# EAGLE design Analog_Light_Project_Improved_Schematic (EAGLE 9.2.2)
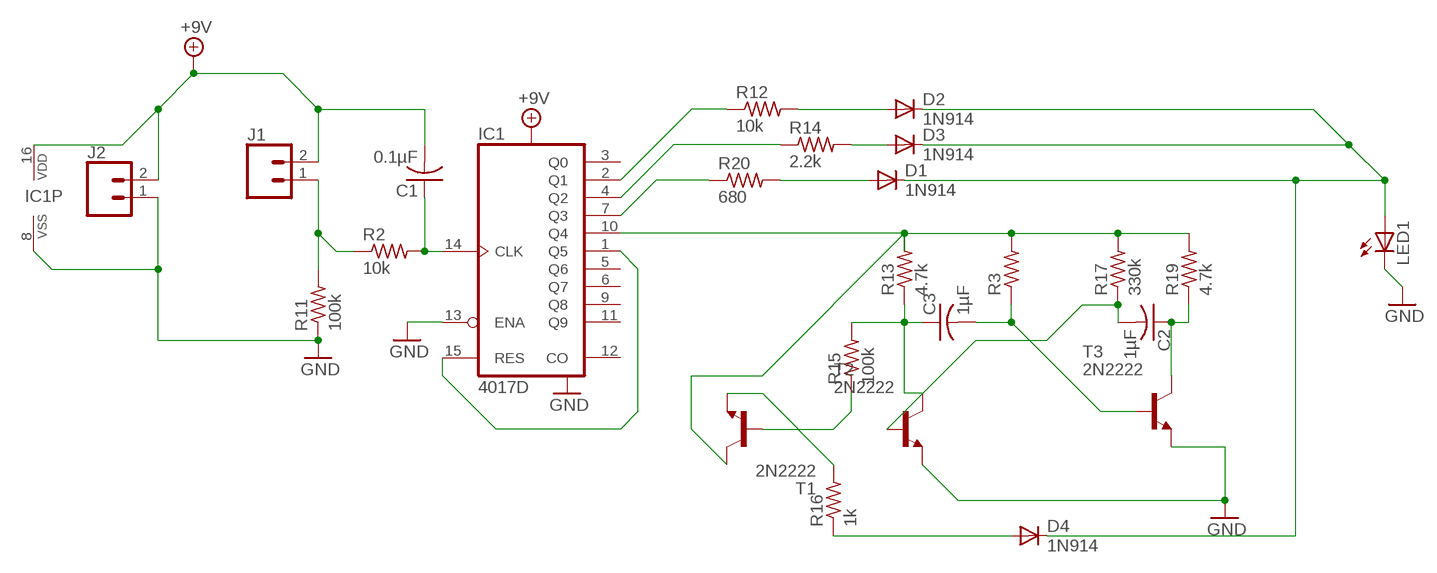
[diagram p0: schematic, sheet 1]

## Parts
C1  0.1µF  C-US025-024X044  [C025-024X044]
C2  1µF  C-USC0805  [C0805]
C3  1µF  C-US025-024X044  [C025-024X044]
D1  1N914  1N4004  [DO41-10]
D2  1N914  1N4004  [DO41-10]
D3  1N914  1N4004  [DO41-10]
D4  1N914  1N4004  [DO41-10]
IC1  4017D  [SO16]
J1  CONN_02  [1X02]
J2  CONN_02  [1X02]
LED1  LED5MM  [LED5MM]
R2  10k  R-US_0204/5  [0204/5]
R3  R-US_0204/5  [0204/5]
R11  100k  R-US_M0805  [M0805]
R12  10k  R-US_M0805  [M0805]
R13  4.7k  R-US_M0805  [M0805]
R14  2.2k  R-US_M0805  [M0805]
R15  100k  R-US_M0805  [M0805]
R16  1k  R-US_M0805  [M0805]
R17  330k  R-US_M0805  [M0805]
R19  4.7k  R-US_M0805  [M0805]
R20  680  R-US_M0805  [M0805]
T1  2N2222  [TO92-EBC-OVAL]
T2  2N2222  [TO92-EBC-OVAL]
T3  2N2222  [TO92-EBC-OVAL]

## Nets
+9V: C1.2 IC1.16(VDD) J1.2 J2.2
GND: IC1.8(VSS) IC1.13(ENA) J2.1 LED1.K(C) R11.1 T2.E T3.E
N$1: IC1.10(Q4) R3.2 R13.2 R17.2 R19.2 T1.C
N$2: C3.1 R13.1 R15.2 T2.C
N$3: C3.2 R3.1 T3.B
N$4: C2.2 R17.1 T2.B
N$5: C2.1 R19.1 T3.C
N$6: IC1.7(Q3) R20.1
N$7: R15.1 T1.B
N$9: D1.C D2.C D3.C D4.C LED1.A
N$10: IC1.4(Q2) R14.1
N$11: IC1.2(Q1) R12.1
N$12: C1.1 IC1.14(CLK) R2.2
N$13: IC1.1(Q5) IC1.15(RES)
N$14: D1.A R20.2
N$15: J1.1 R2.1 R11.2
N$16: D3.A R14.2
N$17: D2.A R12.2
N$18: D4.A R16.1
N$19: R16.2 T1.E
Unconnected: IC1.3(Q0) IC1.5(Q6) IC1.6(Q7) IC1.9(Q8) IC1.11(Q9) IC1.12(CO)

## Library data of the parts
C1 C3 = rcl:C-US: CAPACITOR, American symbol; SPICEPREFIX: C
C2 = adafruit:C-US: CAPACITOR, American symbol
D1-D4 = diode:1N4004: DIODE general purpose rectifier, 1 A
IC1 = 40xx:4017: COUNTER/DIVIDER
J1 J2 = SparkFun-Connectors:CONN_02: Multi connection point. Often used as Generic Header-pin footprint for 0.1 inch spaced/style header connections On any of the 0.1 inch spaced packages, you can populate with these: Break Away Headers - Straight <https://www.sparkfun.com/products/116> (PRT-00116) Break Away Male Headers - Right Angle <https://www.sparkfun.com/products/553> (PRT-00553) Female Headers <https://www.sparkfun.com/products/115> (PRT-00115) Break Away Headers - Machine Pin <https://www.sparkfun.com/products/117> (PRT-00117) Break Away Female Headers - Swiss Machine Pin <https://www.sparkfun.com/products/743> (PRT-00743) For SCREWTERMINALS and SPRING TERMINALS visit here: Screw Terimnals on SparkFun.com <https://www.sparkfun.com/search/results?term=Screw+Terminals> (5mm/3.5mm/2.54mm spacing) This device is also useful as a general connection point to wire up your design to another part of your project. Our various solder wires solder well into these plated through hole pads. Hook-Up Wire - Assortment (Stranded, 22 AWG) <https://www.sparkfun.com/products/11375> (PRT-11375) Hook-Up Wire - Assortment (Solid Core, 22 AWG) <https://www.sparkfun.com/products/11367> (PRT-11367) View the entire wire category on our website here <https://www.sparkfun.com/categories/141> Special notes: Molex polarized connector foot print use with: PRT-08233 with associated crimp pins and housings. 2.54_SCREWTERM for use with PRT-10571. 3.5mm Screw Terminal footprints for PRT-08084 5mm Screw Terminal footprints for use with PRT-08432
LED1 = adafruit:LED: LED OSRAM: - CHIPLED LG R971, LG N971, LY N971, LG Q971, LY Q971, LO R971, LY R971 LH N974, LH R974 LS Q976, LO Q976, LY Q976 LO Q996 - Hyper CHIPLED LW Q18S LB Q993, LB Q99A, LB R99A - SideLED LS A670, LO A670, LY A670, LG A670, LP A670 LB A673, LV A673, LT A673, LW A673 LH A674 LY A675 LS A676, LA A676, LO A676, LY A676, LW A676 LS A679, LY A679, LG A679 - Hyper Micro SIDELED® LS Y876, LA Y876, LO Y876, LY Y876 LT Y87S - SmartLED LW L88C, LW L88S LB L89C, LB L89S, LG L890 LS L89K, LO L89K, LY L89K LS L896, LA L896, LO L896, LY L896 - TOPLED LS T670, LO T670, LY T670, LG T670, LP T670 LSG T670, LSP T670, LSY T670, LOP T670, LYG T670 LG T671, LOG T671, LSG T671 LB T673, LV T673, LT T673, LW T673 LH T674 LS T676, LA T676, LO T676, LY T676, LB T676, LH T676, LSB T676, LW T676 LB T67C, LV T67C, LT T67C, LS T67K, LO T67K, LY T67K, LW E67C LS E67B, LA E67B, LO E67B, LY E67B, LB E67C, LV E67C, LT E67C LW T67C LS T679, LY T679, LG T679 LS T770, LO T770, LY T770, LG T770, LP T770 LB T773, LV T773, LT T773, LW T773 LH T774 LS E675, LA E675, LY E675, LS T675 LS T776, LA T776, LO T776, LY T776, LB T776 LHGB T686 LT T68C, LB T68C - Hyper Mini TOPLED® LB M676 - Mini TOPLED Santana® LG M470 LS M47K, LO M47K, LY M47K Source: http://www.osram.convergy.de/
R2 R3 = rcl:R-US_: RESISTOR, American symbol; SPICEPREFIX: R
R11-R17 R19 R20 = adafruit:R-US_: RESISTOR, American symbol
T1-T3 = adafruit:2N2222: NPN TRANSISTOR Big oval pads

## Board
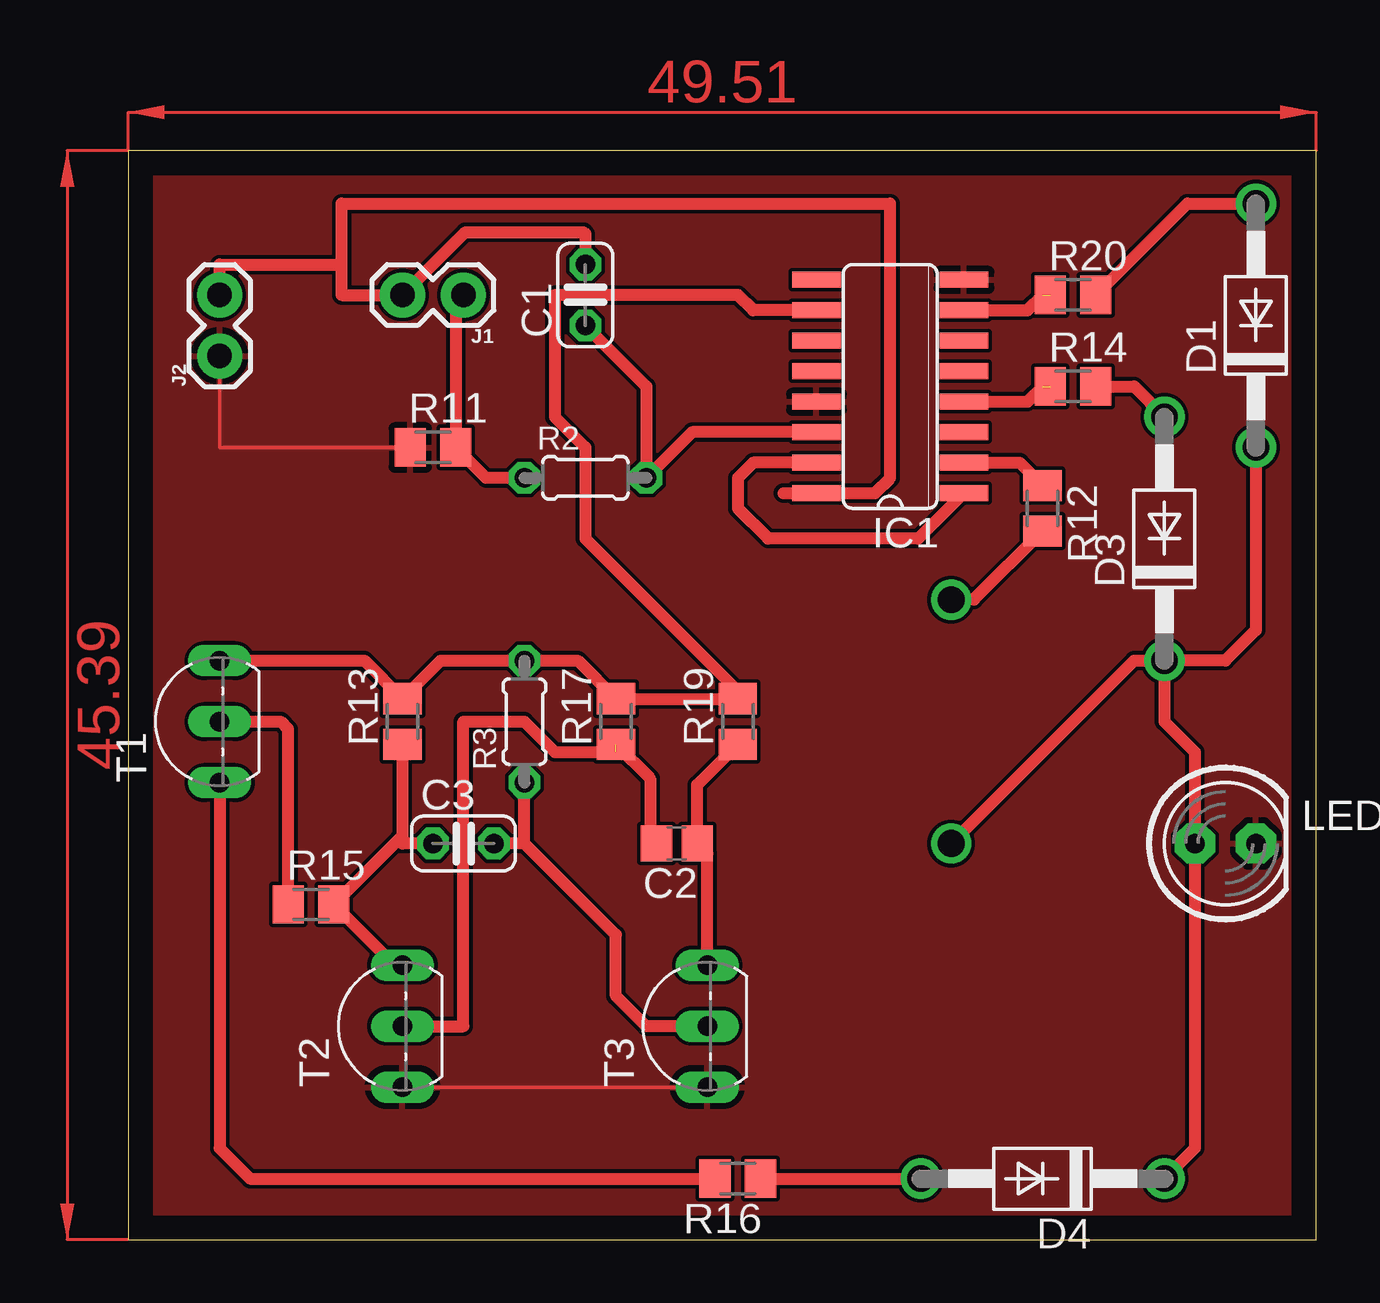
[diagram p1: board, top side]
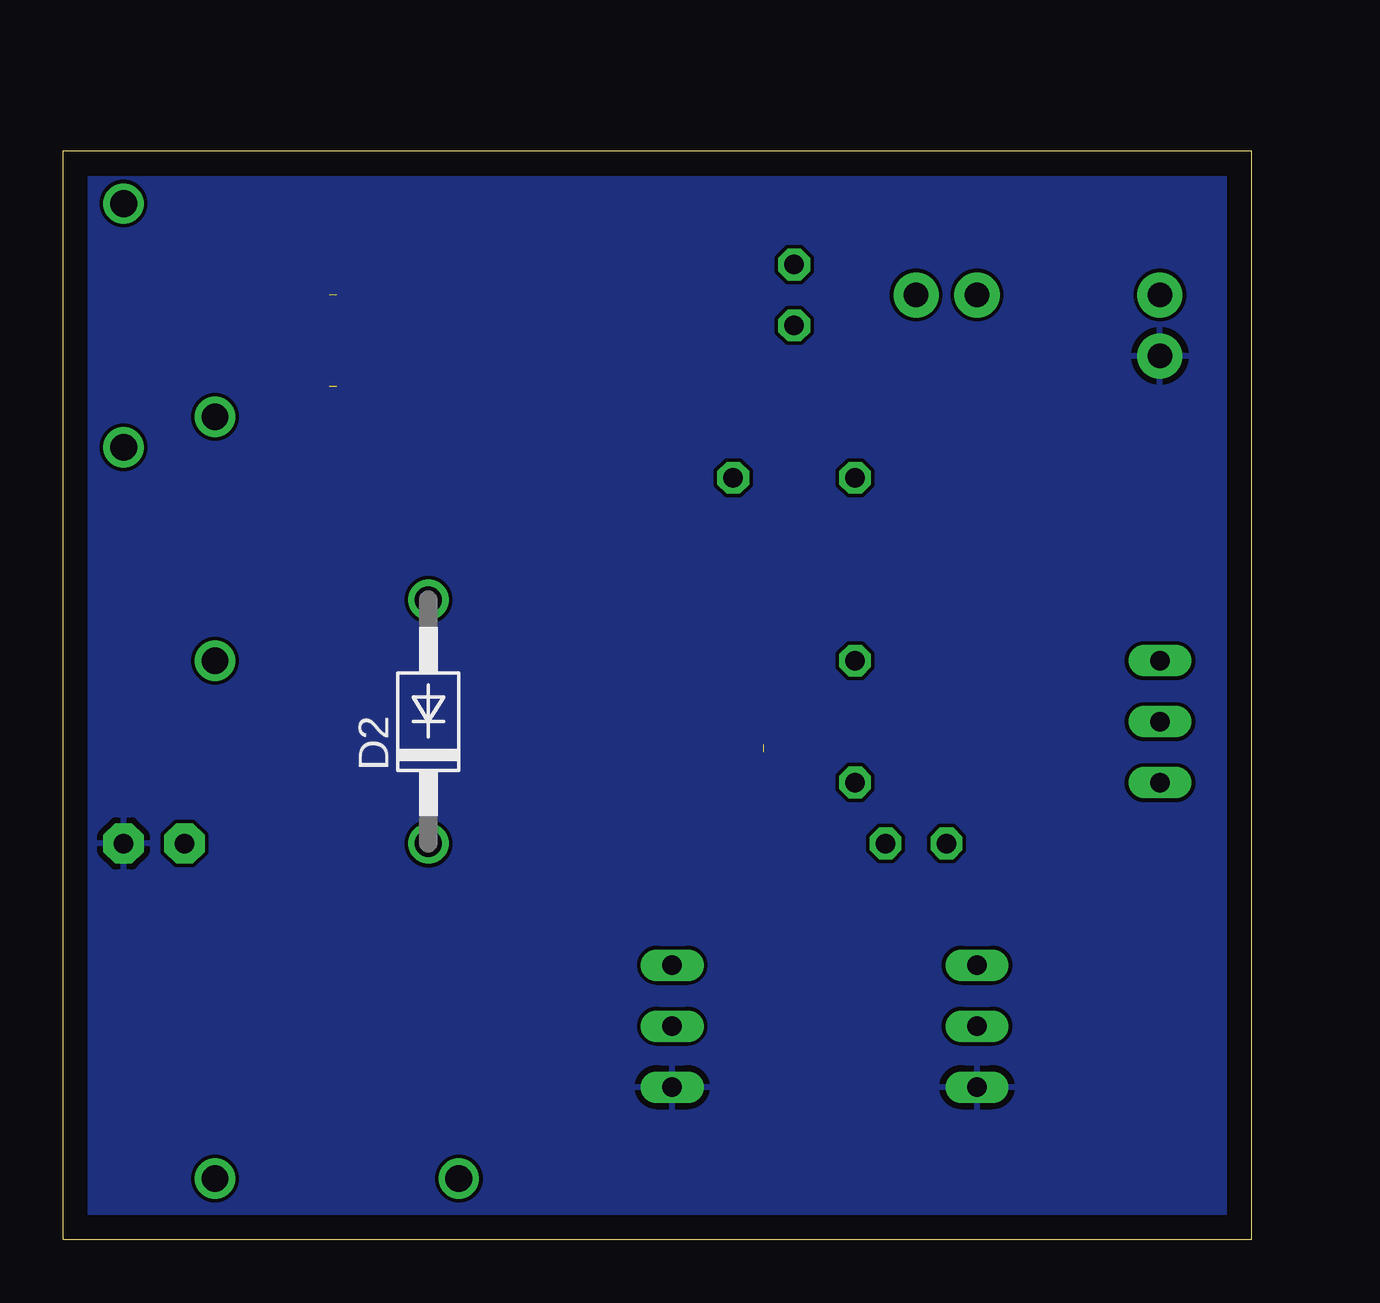
[diagram p2: board, bottom side, seen from below]

Size 49.51 x 45.39 mm. Coordinates in mm from the lower left corner, seen from the top.
Outline: 0,0 49.51,0 49.51,45.39 0,45.39 0,0
Copper layers (1*16): Top 0.035mm / dielectric 1.5mm / Bottom 0.035mm
Design rules "default": minimum track width 6mil, minimum drill 0.35mm, track to track 6mil, track to pad 6mil, pad to pad 6mil, via to via 6mil, smd to smd 6mil, copper to edge 40mil, drill to drill 6mil, minimum pad ring 10mil, minimum via ring 8mil, stop-mask expansion 4mil, vias tented up to drill 0mil, thermal gap 10mil

### Footprints (pad centres in the part's own frame; a part is rotated, then mirrored left to right if it is on the bottom)
C025-024X044 = drill 0.813 octagon: 1 -1.27,0; 2 1.27,0
C0805 = smd 1.3 x 1.5: 1 -0.85,0; 2 0.85,0
DO41-10 = drill 1.118: A 5.08,0; C -5.08,0
SO16 = smd 0.66 x 2.032: 1 -4.445,-3.073; 2 -3.175,-3.073; 3 -1.905,-3.073; 4 -0.635,-3.073; 5 0.635,-3.073; 6 1.905,-3.073; 7 3.175,-3.073; 8 4.445,-3.073; 9 4.445,3.073; 10 3.175,3.073; 11 1.905,3.073; 12 0.635,3.073; 13 -0.635,3.073; 14 -1.905,3.073; 15 -3.175,3.073; 16 -4.445,3.073
1X02 = drill 1.016 pad 1.88: 1 0,0; 2 2.54,0
LED5MM = drill 0.813 pad 1.676 octagon: A -1.27,0; K 1.27,0
0204/5 = drill 0.813 octagon: 1 -2.54,0; 2 2.54,0
M0805 = smd 1.3 x 1.6: 1 -0.95,0; 2 0.95,0
TO92-EBC-OVAL = drill 0.813 long: B 0,-1.27; C 2.54,-1.27; E -2.54,-1.27

### Placement (x,y rotation side)
C1  19.05,39.37 90 top
C2  22.86,16.51 180 top
C3  13.97,16.51 0 top
D1  46.99,38.1 90 top
D2  34.29,21.59 90 bottom
D3  43.18,29.21 90 top
D4  38.1,2.54 180 top
IC1  31.75,35.56 90 top
J1  13.97,39.37 180 top
J2  3.81,36.83 90 top
LED1  45.72,16.51 0 top
R2  19.05,31.75 0 top
R3  16.51,21.59 90 top
R11  12.7,33.02 0 top
R12  38.1,30.48 270 top
R13  11.43,21.59 90 top
R14  39.37,35.56 0 top
R15  7.62,13.97 0 top
R16  25.4,2.54 180 top
R17  20.32,21.59 90 top
R19  25.4,21.59 90 top
R20  39.37,39.37 0 top
T1  2.54,21.59 90 top
T2  10.16,8.89 90 top
T3  22.86,8.89 90 top

### Tracks (layer width: path | path; a pad name or v marks a point on that pad's centre or on a via)
+9V
  Top 0.508: J2.2 3.81,40.64 8.89,40.64 | 8.89,40.64 8.89,39.37 J1.2 14.05,41.99 18.97,41.99 19.05,41.91 C1.2 | 8.89,40.64 8.89,43.18 31.75,43.18 31.75,31.75 31.12,31.11 IC1.16 27.3,31.11
GND
  Top 0.152: R11.1 3.81,33.02 J2.1 | T2.E T3.E
  pour Bottom: -1.27,44.45 156.21,44.45 156.21,-53.34 -1.27,-53.34
  pour Top: -1.27,44.45 156.21,44.45 156.21,-53.34 -1.27,-53.34
N$1
  Top 0.508: IC1.10 26.04,38.73 25.4,39.37 17.78,39.37 17.78,34.29 19.05,33.02 19.05,29.21 25.4,22.86 R19.2 R17.2 18.73,24.13 R3.2 13.02,24.13 R13.2 9.84,24.13 T1.C
N$2
  Top 0.152: T2.C 11.11,11.43
  Top 0.508: 11.11,11.43 R15.2 11.27,16.67 | 11.27,16.67 11.43,16.83 R13.1 | C3.1 11.43,16.51 11.27,16.67
N$3
  Top 0.508: T3.B 21.59,8.89 20.32,10.16 20.32,12.7 16.51,16.51 | 16.51,16.51 C3.2 | 16.51,16.51 R3.1
N$4  (1 unrouted)
  Top 0.152: 21.75,16.77 C2.2
  Top 0.508: R17.1 21.75,19.21 21.75,16.77 | T2.B 13.97,8.89 13.97,21.59 16.51,21.59 17.78,20.32 20.32,20.32
N$5
  Top 0.508: R19.1 23.71,18.95 C2.1 24.13,16.09 T3.C
N$6  (1 unrouted)
  Top 0.508: IC1.7 37.47,38.73 38.1,39.37
N$7
  Top 0.508: R15.1 6.67,21.27 6.35,21.59 T1.B
N$9
  Top 0.508: D4.C 44.45,3.81 LED1.A 44.45,20.32 43.18,21.59 D3.C | D2.C 41.91,24.13 D3.C | D1.C 46.99,25.4 45.72,24.13 D3.C
N$10  (1 unrouted)
  Top 0.508: IC1.4 37.47,34.92 38.1,35.56
N$11
  Top 0.508: IC1.2 37.15,32.39 R12.1
N$12
  Top 0.508: IC1.14 23.5,33.66 R2.2 21.59,35.56 C1.1
N$13
  Top 0.508: IC1.15 26.04,32.39 25.4,31.75 25.4,30.48 26.67,29.21 32.92,29.21 IC1.1
N$14
  Top 0.508: R20.2 44.13,43.18 D1.A
N$15
  Top 0.152: 13.65,35.24 R11.2 14.29,32.39 | J1.1 13.65,39.05
  Top 0.508: 13.65,39.05 R11.2 14.92,31.75 R2.1
N$16
  Top 0.508: R14.2 41.91,35.56 D3.A
N$17
  Top 0.508: R12.2 35.24,26.67 D2.A
N$18
  Top 0.508: R16.1 D4.A
N$19
  Top 0.508: T1.E 3.81,3.81 5.08,2.54 R16.2
(copper drawn outside any net)
  shapes: Top area x2